# EAGLE schematic LEDboard_v0.3-R001 (EAGLE 6.5.0)
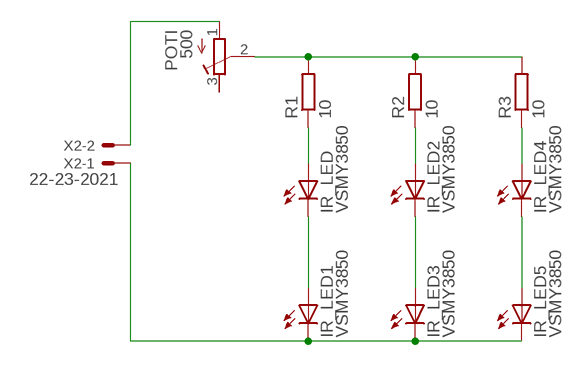
[diagram p0: schematic, sheet 1]

## Parts
IR_LED  VSMY3850  [VSMY3850X]
IR_LED1  VSMY3850  [VSMY3850X]
IR_LED2  VSMY3850  [VSMY3850X]
IR_LED3  VSMY3850  [VSMY3850X]
IR_LED4  VSMY3850  [VSMY3850X]
IR_LED5  VSMY3850  [VSMY3850X]
POTI  500  R-TRIMM64Y  [RTRIM64Y]
R1  10  R-EU_R0805  [R0805]
R2  10  R-EU_R0805  [R0805]
R3  10  R-EU_R0805  [R0805]
X2  22-23-2021  [22-23-2021]

## Nets
N$1: IR_LED1.1(A) IR_LED.2(C)
N$2: IR_LED.1(A) R1.1
N$3: IR_LED2.2(C) IR_LED3.1(A)
N$4: IR_LED2.1(A) R2.1
N$5: IR_LED4.2(C) IR_LED5.1(A)
N$6: IR_LED4.1(A) R3.1
N$7: POTI.2(S) R1.2 R2.2 R3.2
N$8: IR_LED1.2(C) IR_LED3.2(C) IR_LED5.2(C) X2.1
N$9: POTI.1(A) X2.2
Unconnected: POTI.3(E)

## Library data of the parts
IR_LED IR_LED1-IR_LED5 = customizedLibs:VSMY3850: High Speed Infrared Emitting Diode, 850 nm http://www.vishay.com/docs/83399/vsmy3850.pdf DESCRIPTION As part of the SurfLightTM portfolio, the VSMY3850 is an infrared, 850 nm emitting diode based on surface emitter technology with high radiant intensity, high optical power and high speed, molded in a PLCC-2 package for surface mounting (SMD).
POTI = rcl:R-TRIMM: Trimm resistor
R1-R3 = rcl:R-EU_: RESISTOR, European symbol
X2 = con-molex:22-23-2021: .100" (2.54mm) Center Header - 2 Pin; MF: MOLEX; MPN: 22-23-2021; OC_FARNELL: 1462926; OC_NEWARK: 25C3832